# EAGLE schematic radio_interface (EAGLE 6.2)
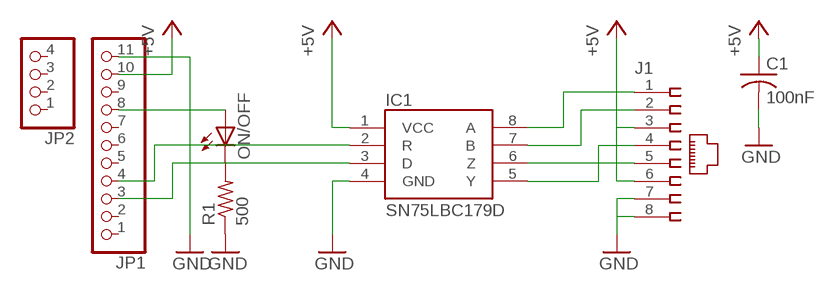
[diagram p0: schematic, sheet 1]

## Parts
C1  100nF  C-USC0805  [C0805]
IC1  SN75LBC179D  [SO08]
J1  215877-7  [215877-7]
JP1  PINHD-1X11  [1X11]
JP2  PINHD-1X4  [1X04]
ON/OFF  LED5MM  [LED5MM]
R1  500  R-US_R0805  [R0805]

## Nets
+5V: C1.1 IC1.1(VCC) J1.3 J1.6 JP1.10
GND: C1.2 IC1.4(GND) J1.7 J1.8 JP1.11 R1.1
N$1: IC1.6(Z) J1.5
N$2: IC1.5(Y) J1.4
N$3: IC1.7(B) J1.2
N$4: IC1.8(A) J1.1
N$5: JP1.8 ON/OFF.A
N$6: IC1.2(R) JP1.4
N$7: IC1.3(D) JP1.3
N$8: ON/OFF.K(C) R1.2
Unconnected: JP1.1 JP1.2 JP1.5 JP1.6 JP1.7 JP1.9 JP2.1 JP2.2 JP2.3 JP2.4

## Library data of the parts
C1 = adafruit:C-US: CAPACITOR, American symbol
IC1 = MSCP_2011_v2:SN75LBC179
J1 = con-amp:215877-7: AMP connector
JP1 = pinhead:PINHD-1X11: PIN HEADER
JP2 = pinhead:PINHD-1X4: PIN HEADER
ON/OFF = adafruit:LED: LED OSRAM: - CHIPLED LG R971, LG N971, LY N971, LG Q971, LY Q971, LO R971, LY R971 LH N974, LH R974 LS Q976, LO Q976, LY Q976 LO Q996 - Hyper CHIPLED LW Q18S LB Q993, LB Q99A, LB R99A - SideLED LS A670, LO A670, LY A670, LG A670, LP A670 LB A673, LV A673, LT A673, LW A673 LH A674 LY A675 LS A676, LA A676, LO A676, LY A676, LW A676 LS A679, LY A679, LG A679 - Hyper Micro SIDELED® LS Y876, LA Y876, LO Y876, LY Y876 LT Y87S - SmartLED LW L88C, LW L88S LB L89C, LB L89S, LG L890 LS L89K, LO L89K, LY L89K LS L896, LA L896, LO L896, LY L896 - TOPLED LS T670, LO T670, LY T670, LG T670, LP T670 LSG T670, LSP T670, LSY T670, LOP T670, LYG T670 LG T671, LOG T671, LSG T671 LB T673, LV T673, LT T673, LW T673 LH T674 LS T676, LA T676, LO T676, LY T676, LB T676, LH T676, LSB T676, LW T676 LB T67C, LV T67C, LT T67C, LS T67K, LO T67K, LY T67K, LW E67C LS E67B, LA E67B, LO E67B, LY E67B, LB E67C, LV E67C, LT E67C LW T67C LS T679, LY T679, LG T679 LS T770, LO T770, LY T770, LG T770, LP T770 LB T773, LV T773, LT T773, LW T773 LH T774 LS E675, LA E675, LY E675, LS T675 LS T776, LA T776, LO T776, LY T776, LB T776 LHGB T686 LT T68C, LB T68C - Hyper Mini TOPLED® LB M676 - Mini TOPLED Santana® LG M470 LS M47K, LO M47K, LY M47K Source: http://www.osram.convergy.de/
R1 = adafruit:R-US_: RESISTOR, American symbol